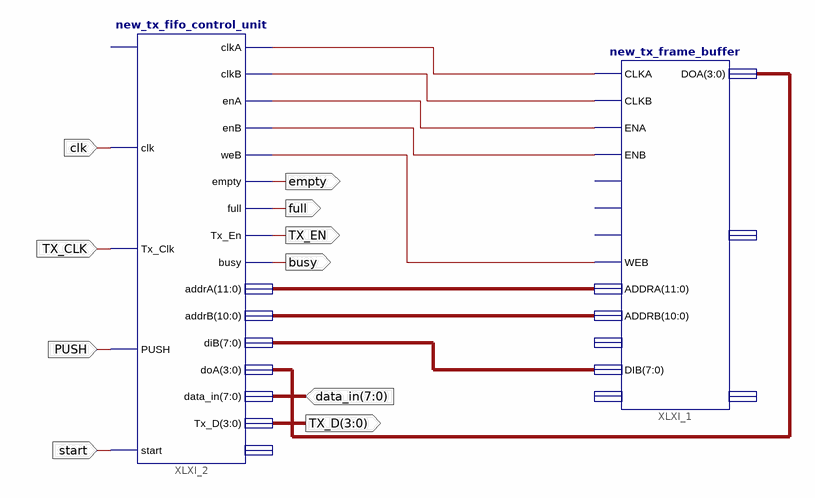
[diagram p0: schematic sheet 1]
// Xilinx ISE schematic ethernetTX.sch (spartan3e) as structural Verilog: 2 symbols, 10 ports
module ethernetTX (
  input  clk,
  input  TX_CLK,
  input  PUSH,
  input  start,
  input  [7:0] data_in,
  output busy,
  output full,
  output TX_EN,
  output empty,
  output [3:0] TX_D
);

  wire XLXN_5, XLXN_6, XLXN_7, XLXN_8, XLXN_9;
  wire [3:0] XLXN_4;
  wire [7:0] XLXN_3;
  wire [10:0] XLXN_2;
  wire [11:0] XLXN_1;

  new_tx_frame_buffer XLXI_1 (
    .CLKA(XLXN_5), .CLKB(XLXN_6), .ENA(XLXN_7), .ENB(XLXN_8), .WEB(XLXN_9), .ADDRA(XLXN_1), .ADDRB(XLXN_2),
    .DIB(XLXN_3), .DOA(XLXN_4));  // open: SSRA, SSRB, WEA, DIA, DIPB, DOB, DOPB
  new_tx_fifo_control_unit XLXI_2 (
    .clk(clk), .Tx_Clk(TX_CLK), .PUSH(PUSH), .start(start), .doA(XLXN_4), .data_in(data_in), .clkA(XLXN_5),
    .clkB(XLXN_6), .enA(XLXN_7), .enB(XLXN_8), .weB(XLXN_9), .empty(empty), .full(full), .Tx_En(TX_EN),
    .busy(busy), .addrA(XLXN_1), .addrB(XLXN_2), .diB(XLXN_3), .Tx_D(TX_D));  // open: EOF, test
endmodule
